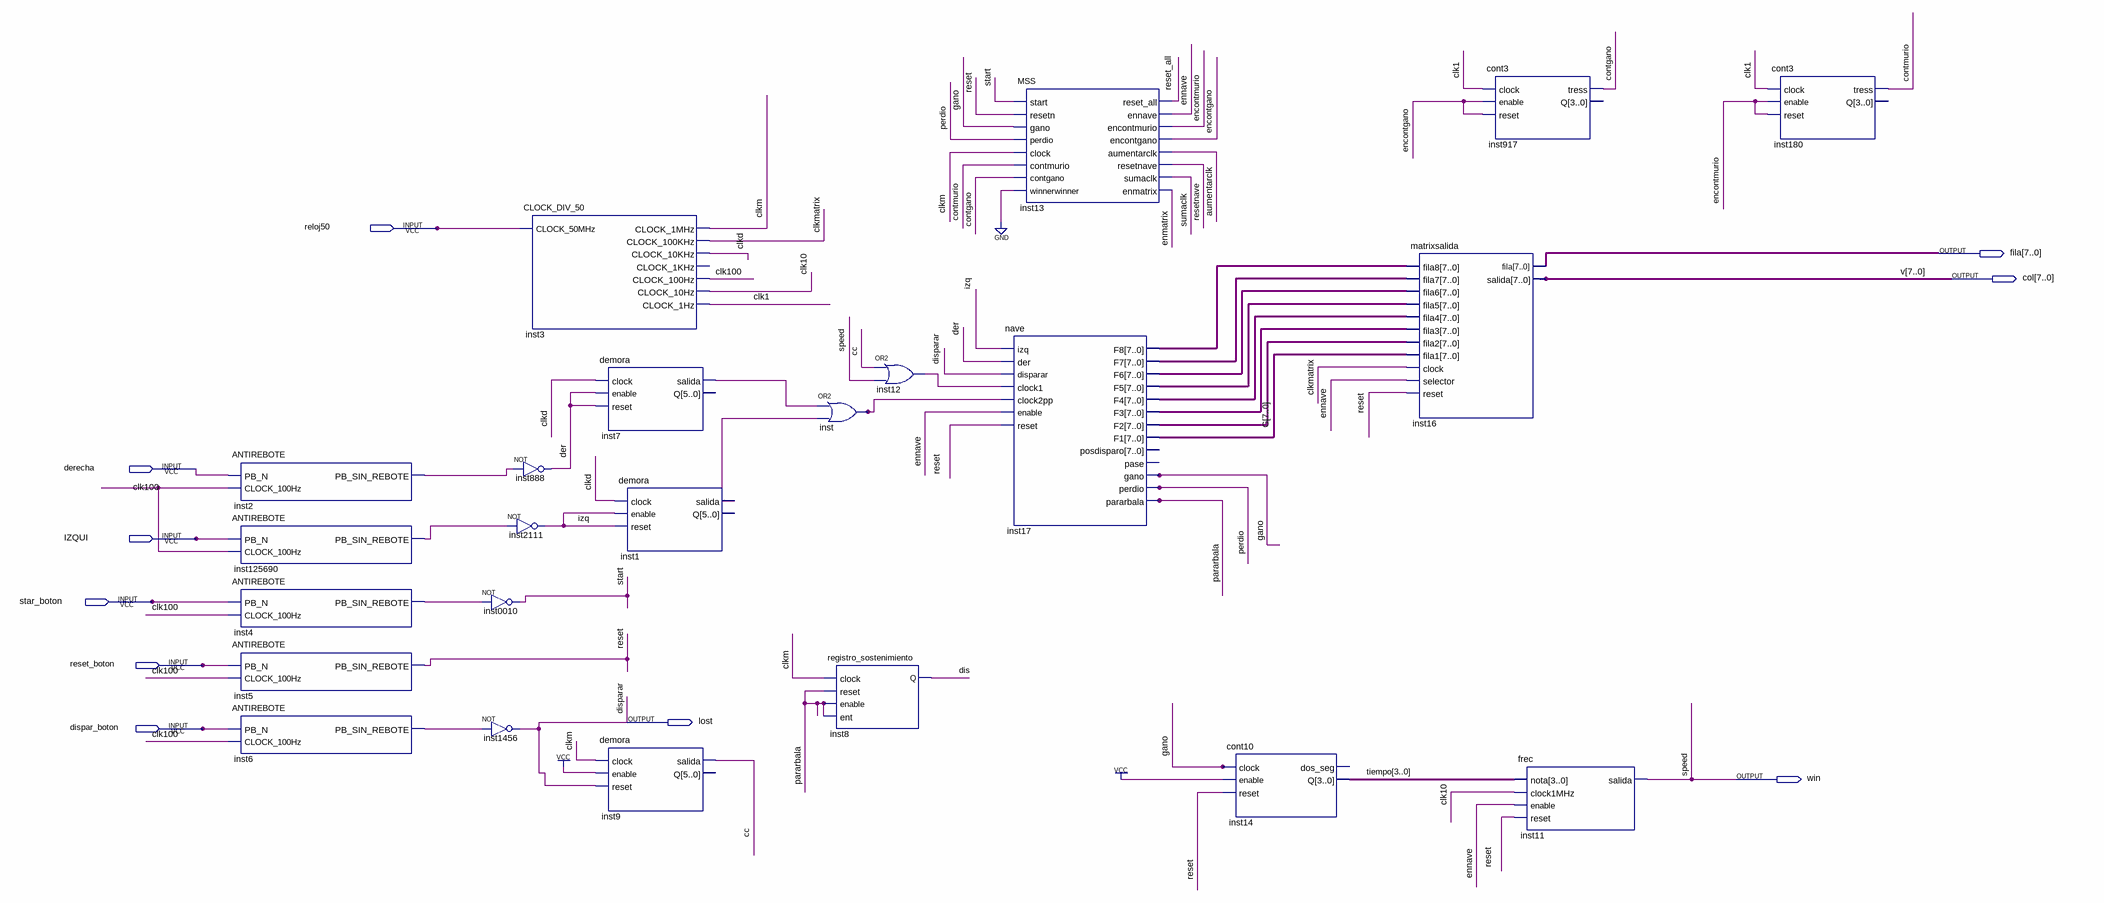
[diagram p0: schematic sheet]
// Quartus schematic alien2.bdf as structural Verilog: 23 symbols, 10 pins
module alien2 (
  input  reloj50,
  input  derecha,
  input  IZQUI,
  input  star_boton,
  input  reset_boton,
  input  dispar_boton,
  output [7:0] fila,
  output [7:0] col,
  output lost,
  output win
);

  wire aumentarclk, cc, clk1, clk10, clk100, clkd, clkm, clkmatrix, contgano, contmurio, der, dis,
       encontgano, encontmurio, enmatrix, ennave, gano, inst1_salida, inst2_pb_sin_rebote,
       inst4_pb_sin_rebote, inst6_pb_sin_rebote, inst7_salida, inst12_out, inst125690_pb_sin_rebote,
       inst_out, izq, pararbala, perdio, reset, reset_all, resetnave, start, sumaclk;
  wire [3:0] tiempo;
  wire [7:0] G, inst17_f2, inst17_f3, inst17_f4, inst17_f5, inst17_f6, inst17_f7, inst17_f8;

  ANTIREBOTE inst2 (.PB_N(derecha), .CLOCK_100Hz(clk100), .PB_SIN_REBOTE(inst2_pb_sin_rebote));
  ANTIREBOTE inst125690 (.PB_N(IZQUI), .CLOCK_100Hz(clk100), .PB_SIN_REBOTE(inst125690_pb_sin_rebote));
  ANTIREBOTE inst4 (.PB_N(star_boton), .CLOCK_100Hz(clk100), .PB_SIN_REBOTE(inst4_pb_sin_rebote));
  ANTIREBOTE inst5 (.PB_N(reset_boton), .CLOCK_100Hz(clk100), .PB_SIN_REBOTE(reset));
  ANTIREBOTE inst6 (.PB_N(dispar_boton), .CLOCK_100Hz(clk100), .PB_SIN_REBOTE(inst6_pb_sin_rebote));
  not inst0010 (start, inst4_pb_sin_rebote);
  not inst1456 (lost, inst6_pb_sin_rebote);
  CLOCK_DIV_50 inst3 (
    .CLOCK_50MHz(reloj50), .CLOCK_1MHz(clkm), .CLOCK_100KHz(clkmatrix), .CLOCK_10KHz(clkd),
    .CLOCK_100Hz(clk100), .CLOCK_10Hz(clk10), .CLOCK_1Hz(clk1));  // open: CLOCK_1KHz
  not inst888 (der, inst2_pb_sin_rebote);
  not inst2111 (izq, inst125690_pb_sin_rebote);
  demora inst7 (.clock(clkd), .enable(der), .reset(der), .salida(inst7_salida));  // open: Q
  demora inst1 (.clock(clkd), .enable(izq), .reset(izq), .salida(inst1_salida));  // open: Q
  demora inst9 (.clock(clkm), .enable(1'b1), .reset(lost), .salida(cc));  // open: Q
  or inst (inst_out, inst7_salida, inst1_salida);
  registro_sostenimiento inst8 (.clock(clkm), .reset(pararbala), .enable(pararbala), .ent(pararbala), .Q(dis));
  or inst12 (inst12_out, cc, win);
  MSS inst13 (
    .start(start), .resetn(reset), .gano(gano), .perdio(perdio), .clock(clkm), .contmurio(contmurio),
    .contgano(contgano), .winnerwinner(1'b0), .reset_all(reset_all), .ennave(ennave),
    .encontmurio(encontmurio), .encontgano(encontgano), .aumentarclk(aumentarclk), .resetnave(resetnave),
    .sumaclk(sumaclk), .enmatrix(enmatrix));
  nave inst17 (
    .izq(izq), .der(der), .disparar(lost), .clock1(inst12_out), .clock2pp(inst_out), .enable(ennave),
    .reset(reset), .F8(inst17_f8), .F7(inst17_f7), .F6(inst17_f6), .F5(inst17_f5), .F4(inst17_f4),
    .F3(inst17_f3), .F2(inst17_f2), .F1(G), .gano(gano), .perdio(perdio), .pararbala(pararbala));  // open: posdisparo, pase
  cont10 inst14 (.clock(gano), .enable(1'b1), .reset(reset), .Q(tiempo));  // open: dos_seg
  matrixsalida inst16 (
    .fila8(inst17_f8), .fila7(inst17_f7), .fila6(inst17_f6), .fila5(inst17_f5), .fila4(inst17_f4),
    .fila3(inst17_f3), .fila2(inst17_f2), .fila1(G), .clock(clkmatrix), .selector(ennave), .reset(reset),
    .fila(fila), .salida(col));
  cont3 inst917 (.clock(clk1), .enable(encontgano), .reset(encontgano), .tress(contgano));  // open: Q
  frec inst11 (.nota(tiempo), .clock1MHz(clk10), .enable(ennave), .reset(reset), .salida(win));
  cont3 inst180 (.clock(clk1), .enable(encontmurio), .reset(encontmurio), .tress(contmurio));  // open: Q

  // Other names for the same wires on the sheet: disparar = lost; speed = win; v[7:0] = col
endmodule
